# Altium schematic sheet Connector_Outside.SchDoc
size A; SheetNumber: 12; SheetTotal: 15
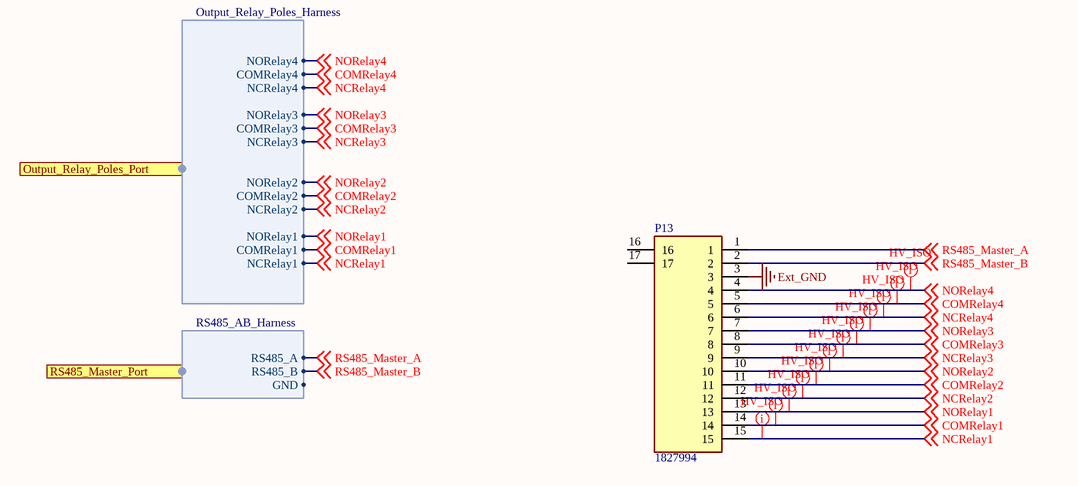
[diagram p0: Connector_Outside.SchDoc]

## Parts
P13  1827994  [1827994]

## Ports
Output_Relay_Poles_Port (harness Output_Relay_Poles_Harness), RS485_Master_Port (harness RS485_AB_Harness)

## Harnesses
Output_Relay_Poles_Harness: NCRelay1, NCRelay2, NCRelay3, NCRelay4, COMRelay1, COMRelay2, COMRelay3, COMRelay4, NORelay1, NORelay2, NORelay3, NORelay4
RS485_AB_Harness: RS485_A, RS485_B, GND

## Nets
Ext_GND: P13.3
COMRelay1: P13.14 ; off-sheet COMRelay1, port Output_Relay_Poles_Port.COMRelay1
COMRelay2: P13.11 ; off-sheet COMRelay2, port Output_Relay_Poles_Port.COMRelay2
COMRelay3: P13.8 ; off-sheet COMRelay3, port Output_Relay_Poles_Port.COMRelay3
COMRelay4: P13.5 ; off-sheet COMRelay4, port Output_Relay_Poles_Port.COMRelay4
NCRelay1: P13.15 ; off-sheet NCRelay1, port Output_Relay_Poles_Port.NCRelay1
NCRelay2: P13.12 ; off-sheet NCRelay2, port Output_Relay_Poles_Port.NCRelay2
NCRelay3: P13.9 ; off-sheet NCRelay3, port Output_Relay_Poles_Port.NCRelay3
NCRelay4: P13.6 ; off-sheet NCRelay4, port Output_Relay_Poles_Port.NCRelay4
NORelay1: P13.13 ; off-sheet NORelay1, port Output_Relay_Poles_Port.NORelay1
NORelay2: P13.10 ; off-sheet NORelay2, port Output_Relay_Poles_Port.NORelay2
NORelay3: P13.7 ; off-sheet NORelay3, port Output_Relay_Poles_Port.NORelay3
NORelay4: P13.4 ; off-sheet NORelay4, port Output_Relay_Poles_Port.NORelay4
RS485_Master_A: P13.1 ; off-sheet RS485_Master_A, port RS485_Master_Port.RS485_A
RS485_Master_B: P13.2 ; off-sheet RS485_Master_B, port RS485_Master_Port.RS485_B

Not connected (* = marked no-connect by the designer): P13 16 17

## Layout directives
net class HV_ISO: COMRelay1, COMRelay2, COMRelay3, COMRelay4, NCRelay1, NCRelay2, NCRelay3, NCRelay4, NORelay1, NORelay2, NORelay3, NORelay4

## Library data of the parts
P13 = 1827994: Connector; Manufacturer_Name: Phoenix Contact; Manufacturer_Part_Number: 1827994; Mouser Part Number: 651-1827994; Digi-Key_Part_Number: 277-6415-ND; Manufacturer_P/N: 1827994; JLC P/N: C6655796